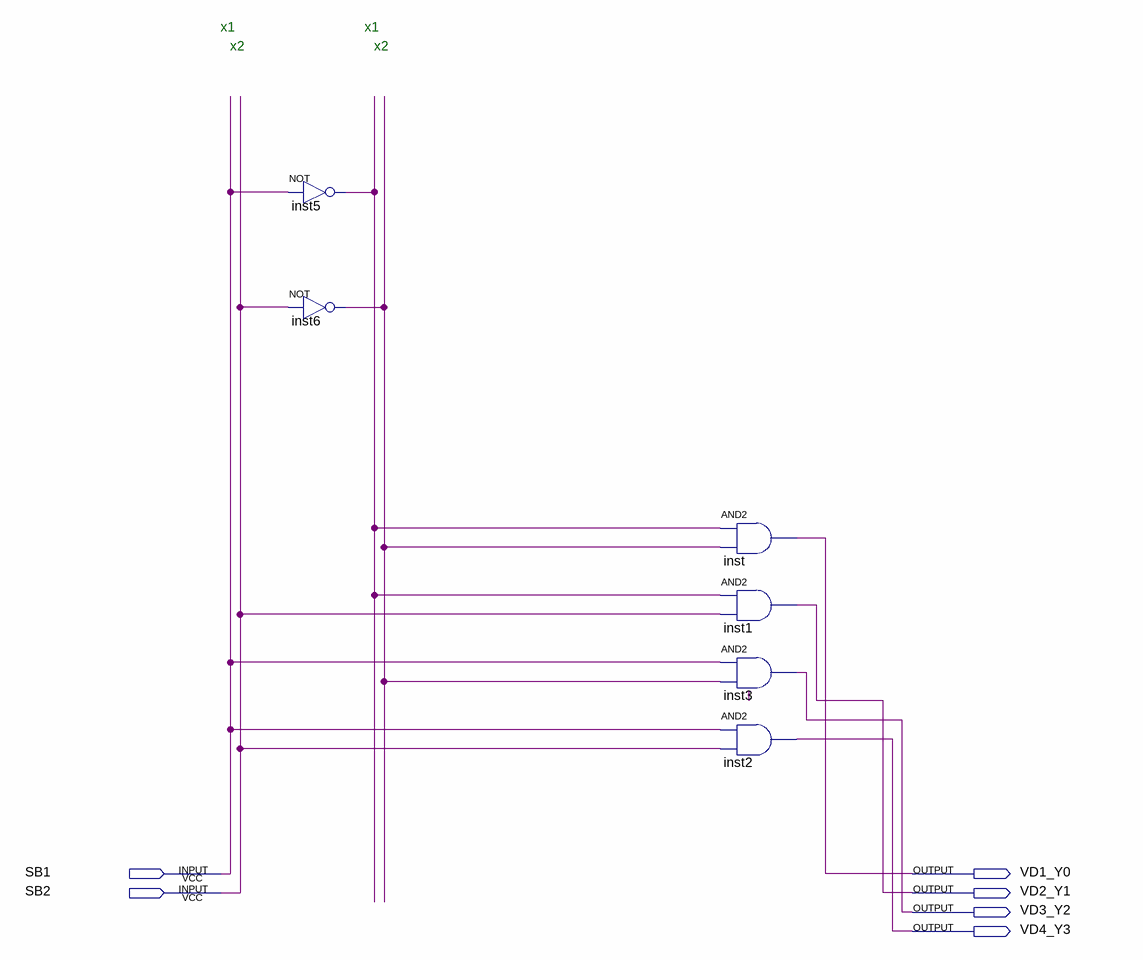
[diagram p0: schematic sheet]
// Quartus schematic Mark6.bdf as structural Verilog: 6 symbols, 6 pins
module Mark6 (
  input  SB1,
  input  SB2,
  output VD1_Y0,
  output VD2_Y1,
  output VD3_Y2,
  output VD4_Y3
);

  wire inst5_out, inst6_out;

  not inst5 (inst5_out, SB1);
  not inst6 (inst6_out, SB2);
  and inst (VD1_Y0, inst5_out, inst6_out);
  and inst1 (VD2_Y1, inst5_out, SB2);
  and inst3 (VD3_Y2, SB1, inst6_out);
  and inst2 (VD4_Y3, SB1, SB2);

  // Notes on the sheet:
  //   x1
  //   x1
  //   x2
  //   x2
endmodule
